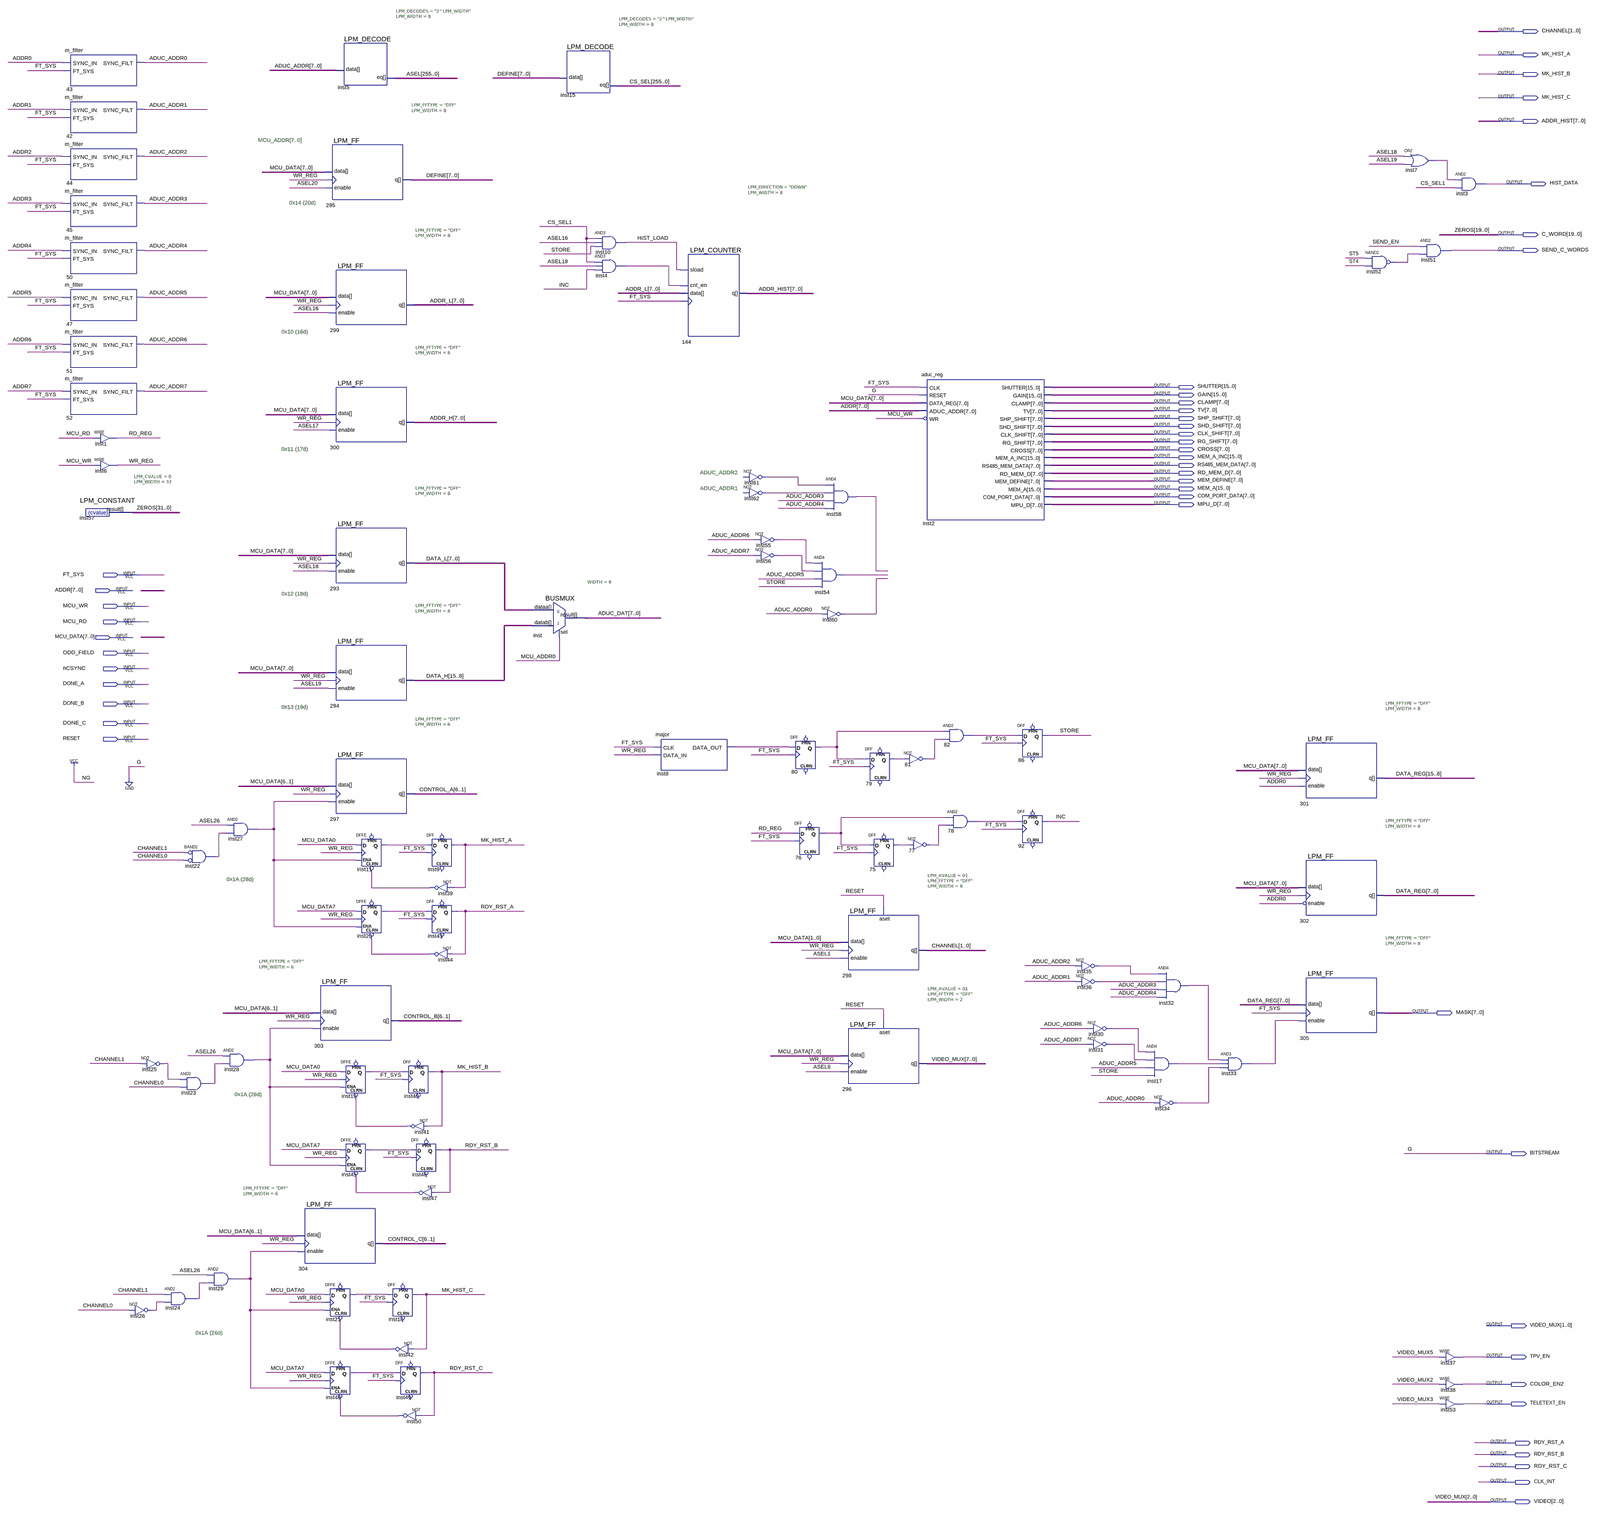
[diagram p0: schematic sheet, whole]
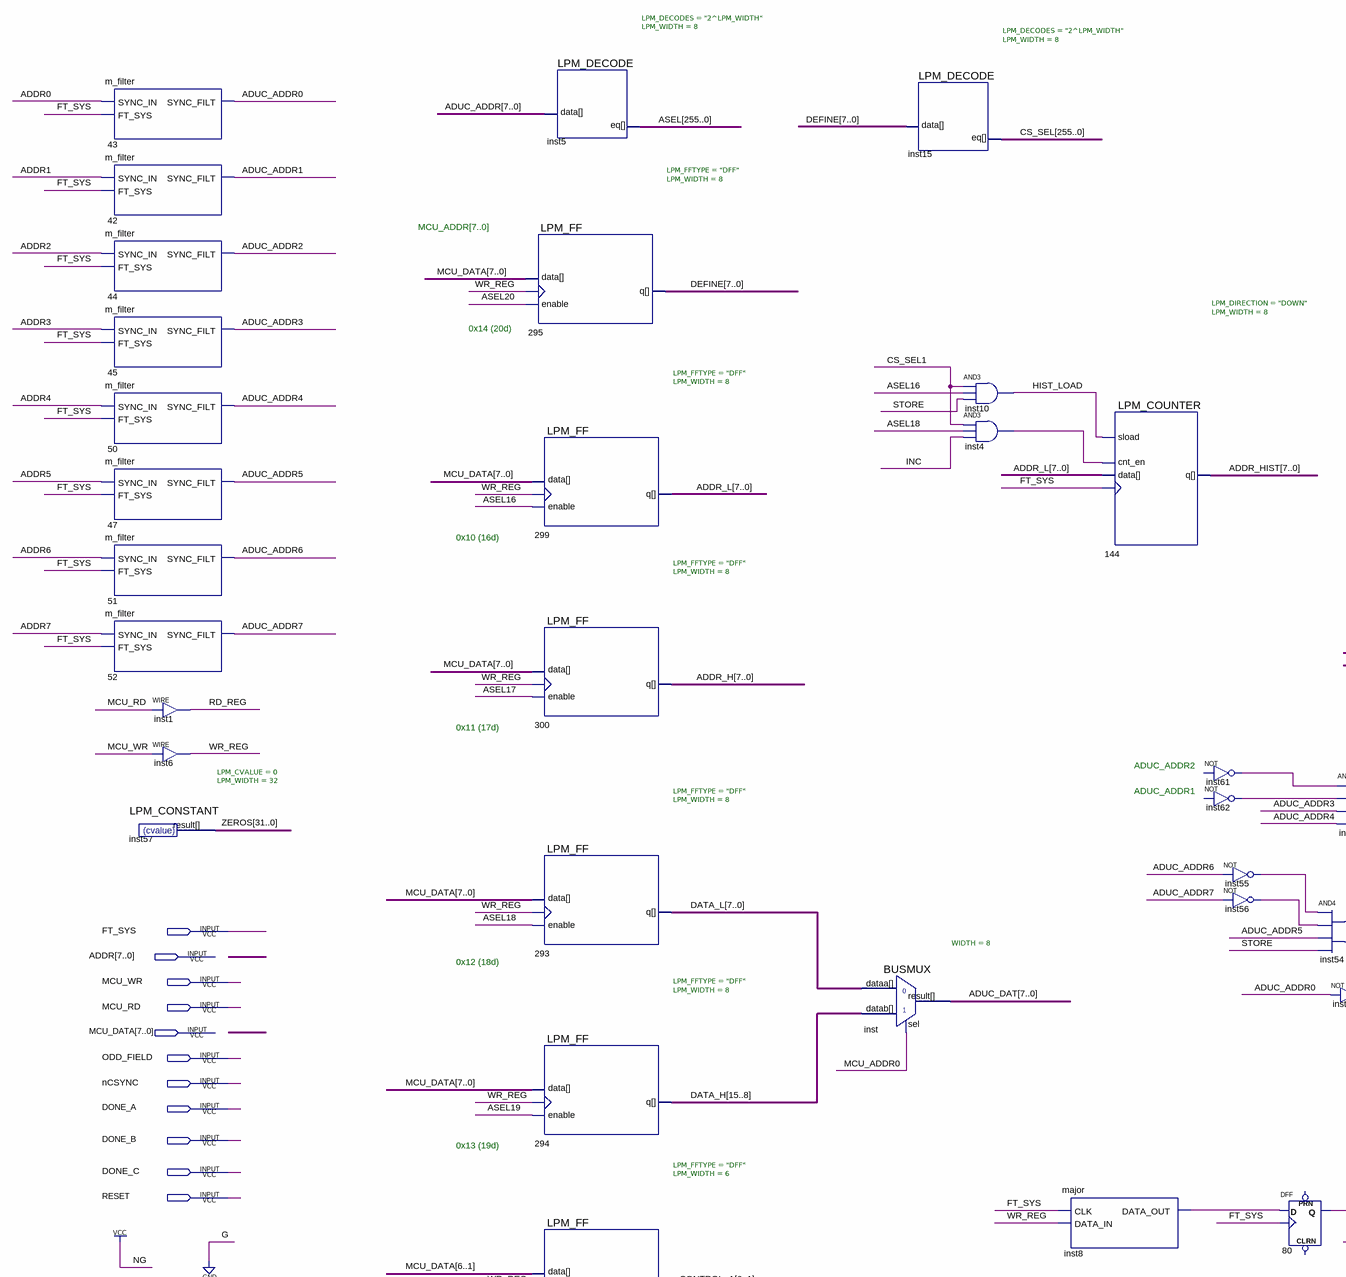
[diagram p1: schematic sheet, upper left part]
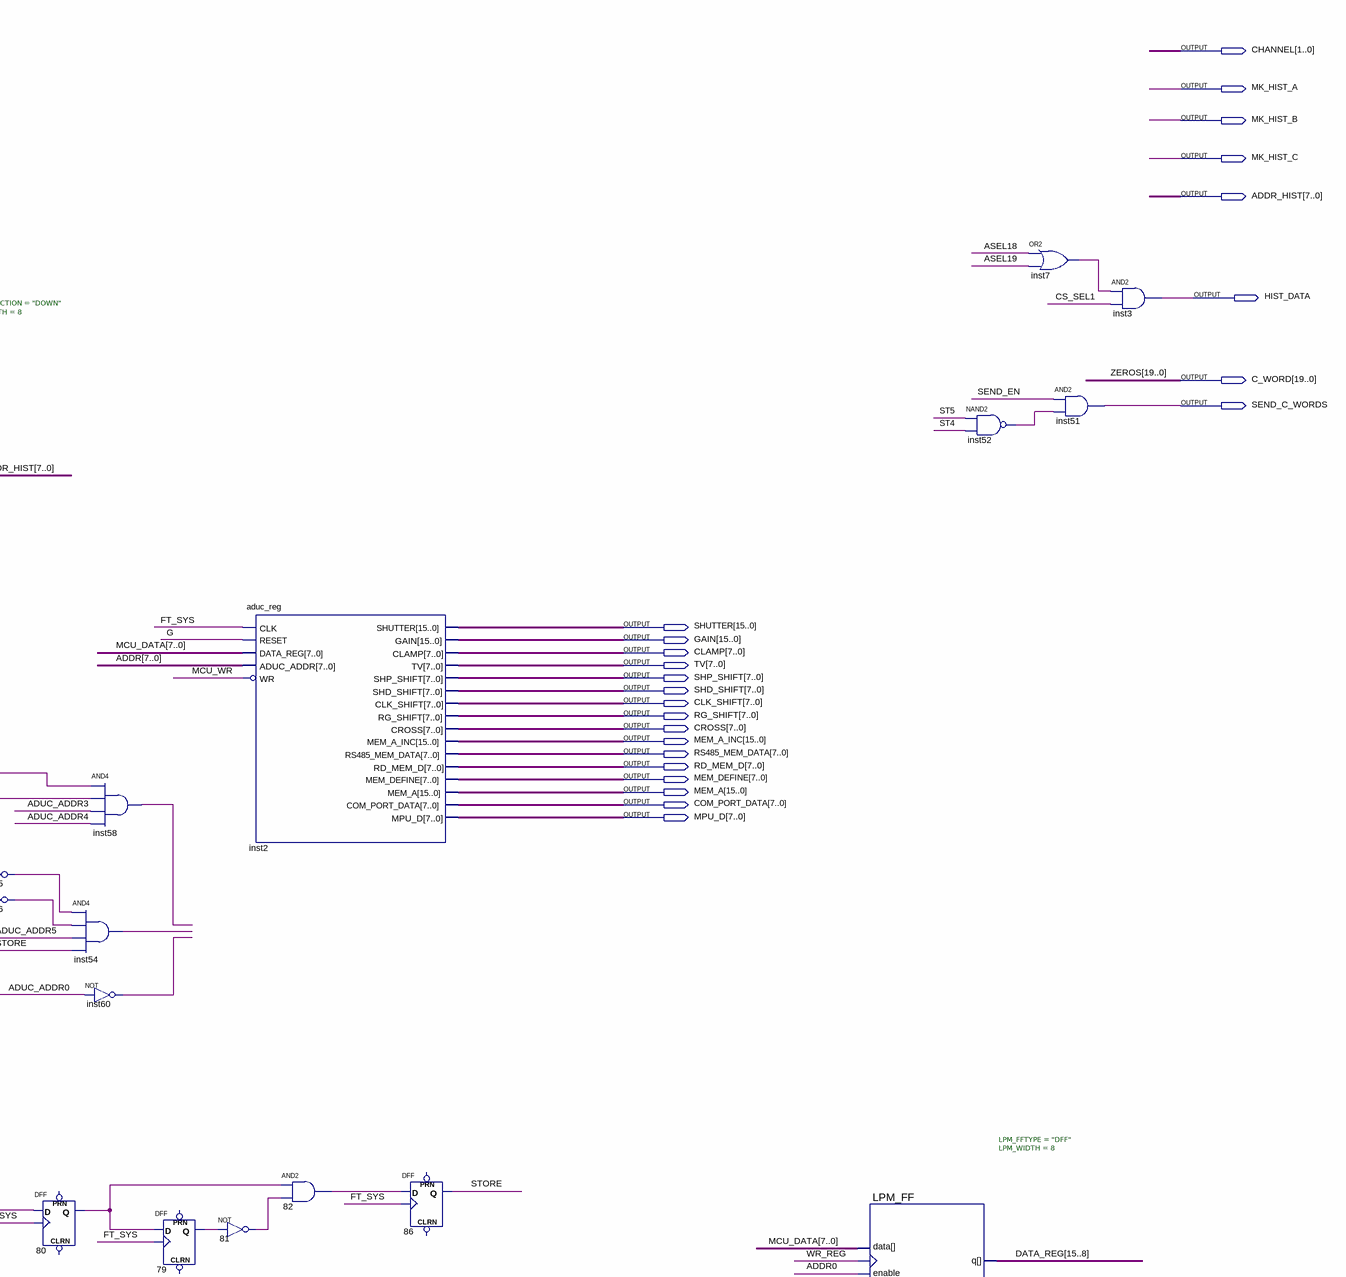
[diagram p2: schematic sheet, upper right part]
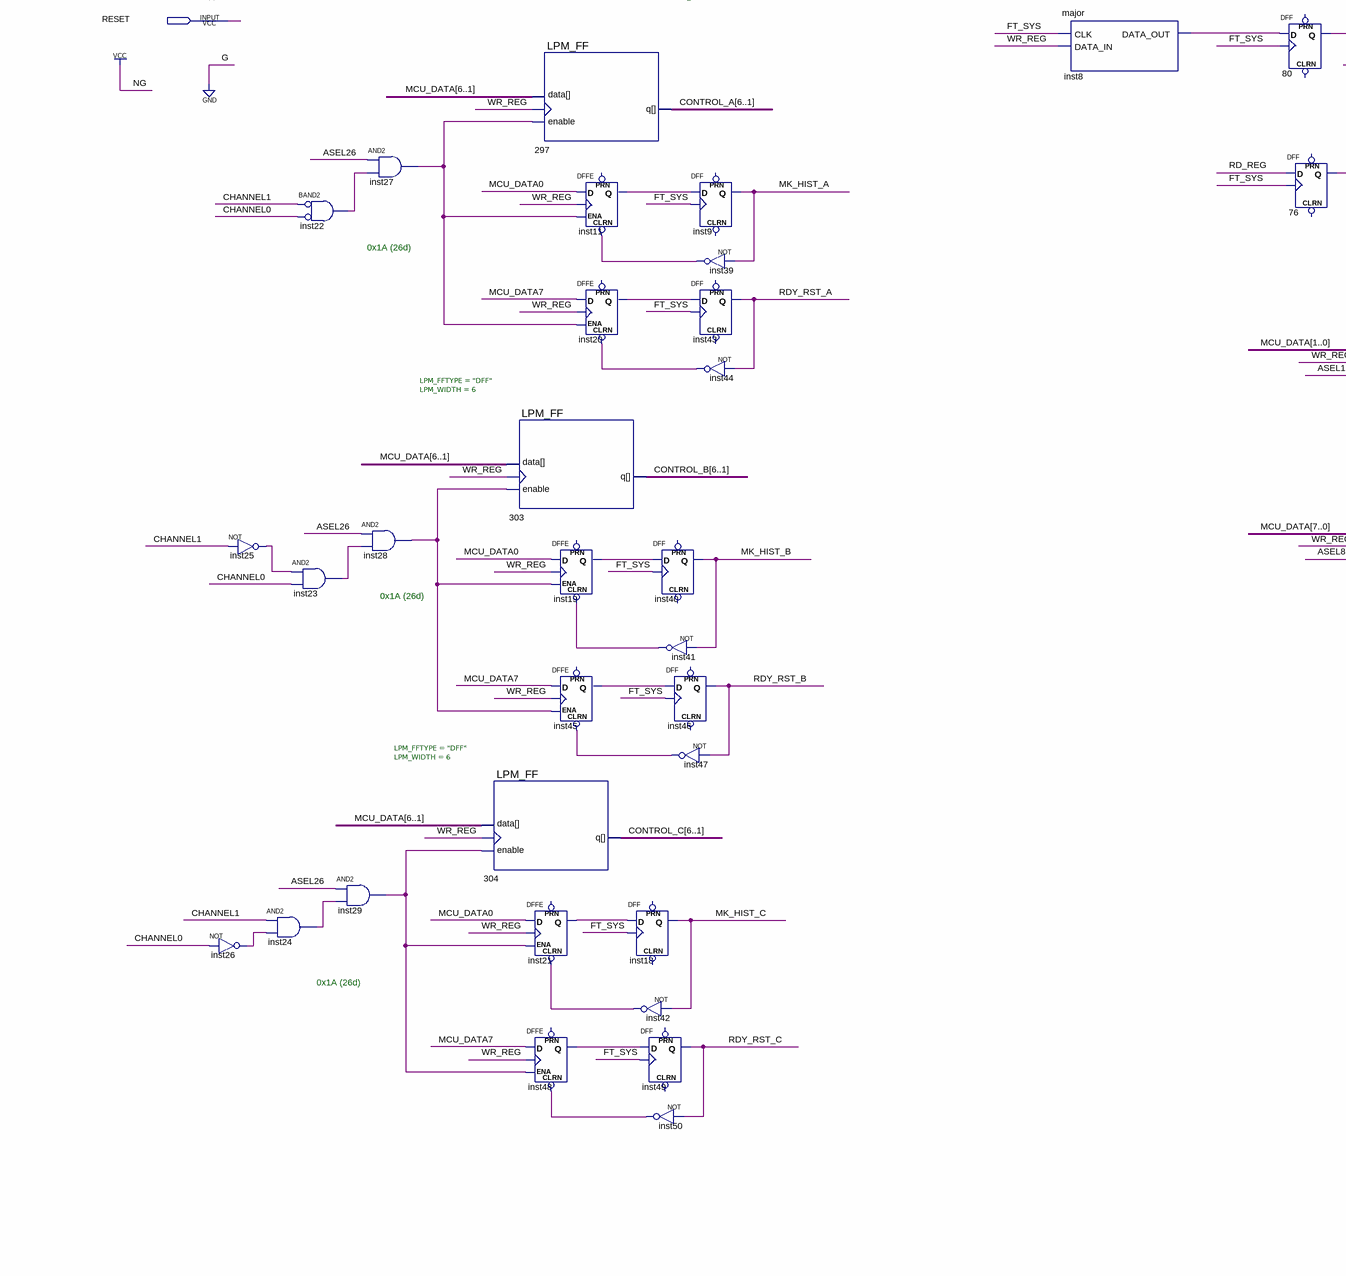
[diagram p3: schematic sheet, lower left part]
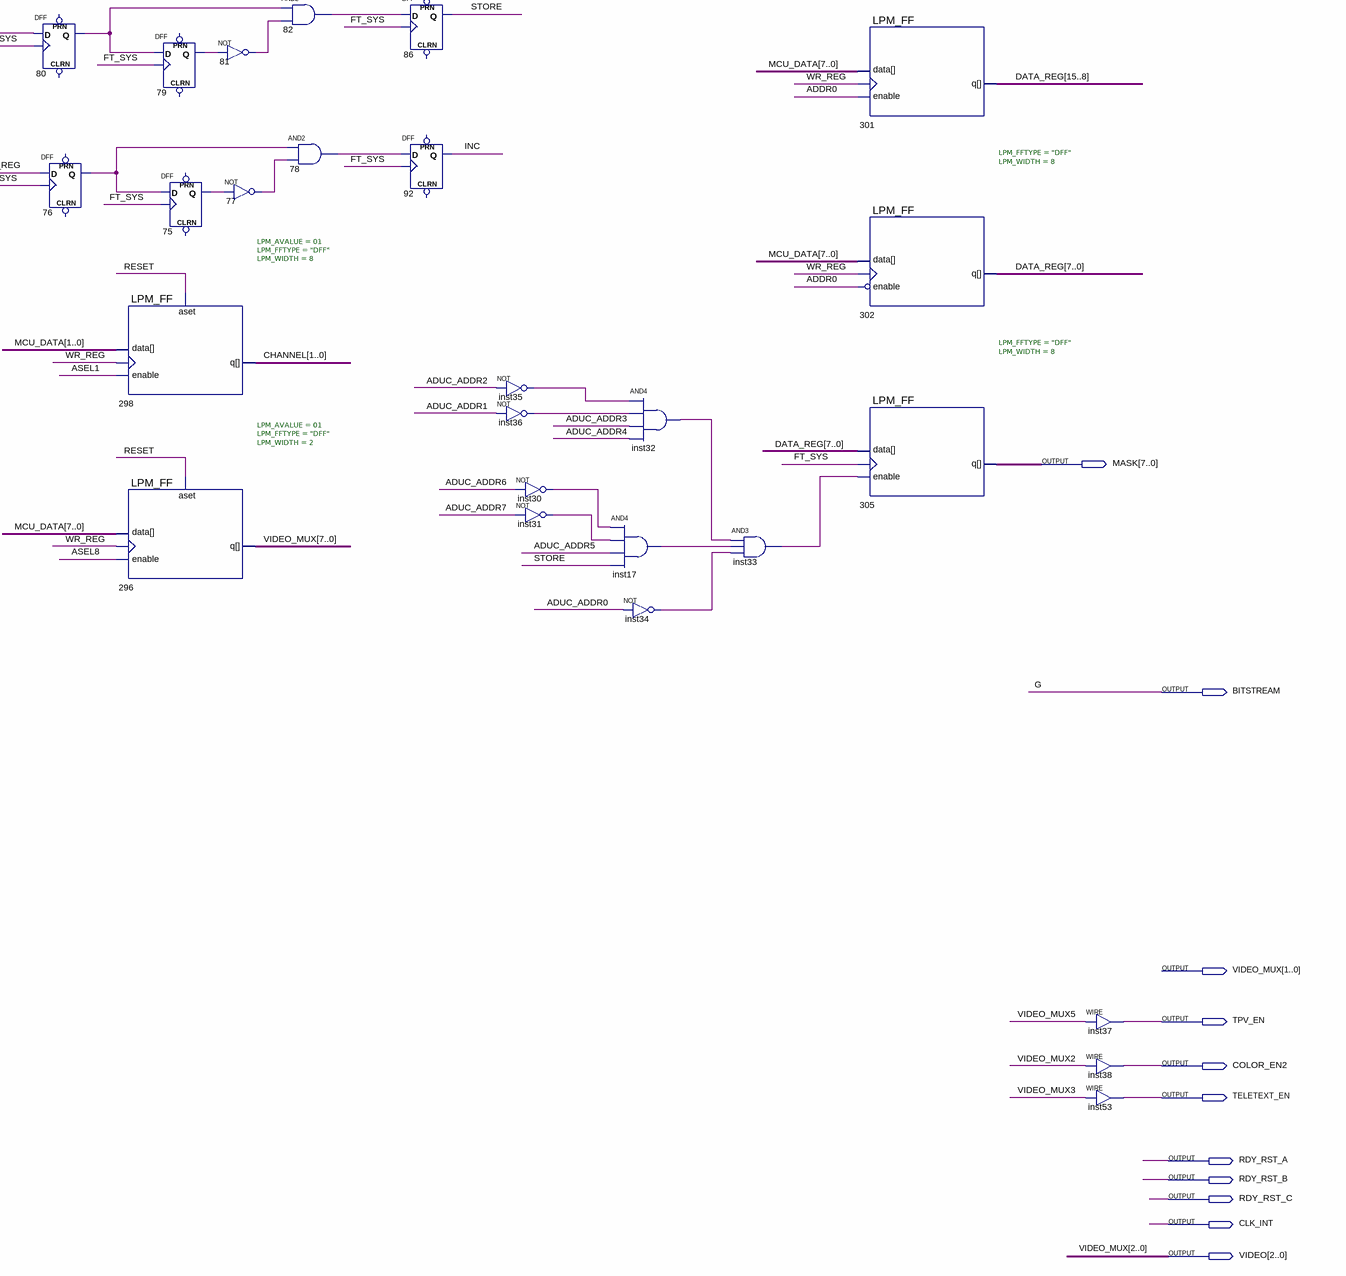
[diagram p4: schematic sheet, lower right part]
// Quartus schematic three_ctrl_k.bdf as structural Verilog: 90 symbols, 46 pins
module three_ctrl_k (
  input  FT_SYS,
  input  [7:0] ADDR,
  input  MCU_WR,
  input  MCU_RD,
  input  [7:0] MCU_DATA,
  input  ODD_FIELD,
  input  nCSYNC,
  input  DONE_A,
  input  DONE_B,
  input  DONE_C,
  input  RESET,
  output [1:0] CHANNEL,
  output MK_HIST_A,
  output MK_HIST_B,
  output MK_HIST_C,
  output [7:0] ADDR_HIST,
  output HIST_DATA,
  output [19:0] C_WORD,
  output SEND_C_WORDS,
  output [15:0] SHUTTER,
  output [15:0] GAIN,
  output [7:0] CLAMP,
  output [7:0] TV,
  output [7:0] SHP_SHIFT,
  output [7:0] SHD_SHIFT,
  output [7:0] CLK_SHIFT,
  output [7:0] RG_SHIFT,
  output [7:0] CROSS,
  output [15:0] MEM_A_INC,
  output [7:0] RS485_MEM_DATA,
  output [7:0] RD_MEM_D,
  output [7:0] MEM_DEFINE,
  output [15:0] MEM_A,
  output [7:0] COM_PORT_DATA,
  output [7:0] MPU_D,
  output [7:0] MASK,
  output BITSTREAM,
  output [7:0] VIDEO_MUX,
  output TPV_EN,
  output COLOR_EN2,
  output TELETEXT_EN,
  output RDY_RST_A,
  output RDY_RST_B,
  output RDY_RST_C,
  output CLK_INT,
  output [2:0] VIDEO
);

  wire HIST_LOAD, INC, inst4_out, inst7_out, inst8_data_out, inst11_q, inst17_out, inst19_q, inst20_q,
       inst21_q, inst22_out, inst23_out, inst24_out, inst25_out, inst26_out, inst27_out, inst28_out,
       inst29_out, inst30_out, inst31_out, inst32_out, inst33_out, inst34_out, inst35_out, inst36_out,
       inst39_out, inst41_out, inst42_out, inst44_out, inst45_q, inst47_out, inst48_q, inst50_out,
       inst52_out, inst54_out, inst55_out, inst56_out, inst58_out, inst60_out, inst61_out, inst62_out,
       MCU_ADDR0, n75_q, n76_q, n77_out, n78_out, n79_q, n80_q, n81_out, n82_out, RD_REG, SEND_EN, ST4, ST5,
       STORE, WR_REG;
  wire [6:1] CONTROL_A, CONTROL_B, CONTROL_C;
  wire [7:0] ADDR_H, ADDR_L, ADUC_ADDR, ADUC_DAT, DATA_L, DEFINE;
  wire [15:0] DATA_REG;
  wire [15:8] DATA_H;
  wire [31:20] ZEROS;
  wire [255:0] ASEL, CS_SEL;

  m_filter u_43 (.SYNC_IN(ADDR[0]), .FT_SYS(FT_SYS), .SYNC_FILT(ADUC_ADDR[0]));
  m_filter u_42 (.SYNC_IN(ADDR[1]), .FT_SYS(FT_SYS), .SYNC_FILT(ADUC_ADDR[1]));
  m_filter u_44 (.SYNC_IN(ADDR[2]), .FT_SYS(FT_SYS), .SYNC_FILT(ADUC_ADDR[2]));
  m_filter u_45 (.SYNC_IN(ADDR[3]), .FT_SYS(FT_SYS), .SYNC_FILT(ADUC_ADDR[3]));
  m_filter u_50 (.SYNC_IN(ADDR[4]), .FT_SYS(FT_SYS), .SYNC_FILT(ADUC_ADDR[4]));
  m_filter u_47 (.SYNC_IN(ADDR[5]), .FT_SYS(FT_SYS), .SYNC_FILT(ADUC_ADDR[5]));
  m_filter u_51 (.SYNC_IN(ADDR[6]), .FT_SYS(FT_SYS), .SYNC_FILT(ADUC_ADDR[6]));
  m_filter u_52 (.SYNC_IN(ADDR[7]), .FT_SYS(FT_SYS), .SYNC_FILT(ADUC_ADDR[7]));
  assign RD_REG = MCU_RD;  // WIRE inst1
  assign WR_REG = MCU_WR;  // WIRE inst6
  LPM_CONSTANT #(.LPM_CVALUE(0), .LPM_WIDTH(32)) inst57 (.result({ZEROS, C_WORD}));
  not inst26 (inst26_out, CHANNEL[0]);
  not inst25 (inst25_out, CHANNEL[1]);
  and inst24 (inst24_out, CHANNEL[1], inst26_out);
  and inst22 (inst22_out, ~CHANNEL[1], ~CHANNEL[0]);  // BAND2
  and inst23 (inst23_out, inst25_out, CHANNEL[0]);
  and inst27 (inst27_out, ASEL[26], inst22_out);
  and inst28 (inst28_out, ASEL[26], inst23_out);
  and inst29 (inst29_out, ASEL[26], inst24_out);
  LPM_FF #(.LPM_FFTYPE("DFF"), .LPM_WIDTH(8)) u_295 (.enable(ASEL[20]), .clock(WR_REG), .data(MCU_DATA), .q(DEFINE));
  LPM_FF #(.LPM_FFTYPE("DFF"), .LPM_WIDTH(6)) u_303 (
    .enable(inst28_out), .clock(WR_REG), .data(MCU_DATA[6:1]), .q(CONTROL_B));
  LPM_FF #(.LPM_FFTYPE("DFF"), .LPM_WIDTH(6)) u_304 (
    .enable(inst29_out), .clock(WR_REG), .data(MCU_DATA[6:1]), .q(CONTROL_C));
  DFFE inst21 (.CLRN(inst42_out), .D(MCU_DATA[0]), .CLK(WR_REG), .ENA(inst29_out), .Q(inst21_q));  // open: PRN
  DFFE inst48 (.CLRN(inst50_out), .D(MCU_DATA[7]), .CLK(WR_REG), .ENA(inst29_out), .Q(inst48_q));  // open: PRN
  LPM_DECODE #(.LPM_DECODES("2^LPM_WIDTH"), .LPM_WIDTH(8)) inst5 (.data(ADUC_ADDR), .eq(ASEL));
  LPM_FF #(.LPM_FFTYPE("DFF"), .LPM_WIDTH(8)) u_299 (.enable(ASEL[16]), .clock(WR_REG), .data(MCU_DATA), .q(ADDR_L));
  LPM_FF #(.LPM_FFTYPE("DFF"), .LPM_WIDTH(8)) u_300 (.enable(ASEL[17]), .clock(WR_REG), .data(MCU_DATA), .q(ADDR_H));
  LPM_FF #(.LPM_FFTYPE("DFF"), .LPM_WIDTH(8)) u_293 (.enable(ASEL[18]), .clock(WR_REG), .data(MCU_DATA), .q(DATA_L));
  LPM_FF #(.LPM_FFTYPE("DFF"), .LPM_WIDTH(8)) u_294 (.enable(ASEL[19]), .clock(WR_REG), .data(MCU_DATA), .q(DATA_H));
  LPM_FF #(.LPM_FFTYPE("DFF"), .LPM_WIDTH(6)) u_297 (
    .enable(inst27_out), .clock(WR_REG), .data(MCU_DATA[6:1]), .q(CONTROL_A));
  DFFE inst11 (.CLRN(inst39_out), .D(MCU_DATA[0]), .CLK(WR_REG), .ENA(inst27_out), .Q(inst11_q));  // open: PRN
  DFFE inst20 (.CLRN(inst44_out), .D(MCU_DATA[7]), .CLK(WR_REG), .ENA(inst27_out), .Q(inst20_q));  // open: PRN
  DFFE inst19 (.CLRN(inst41_out), .D(MCU_DATA[0]), .CLK(WR_REG), .ENA(inst28_out), .Q(inst19_q));  // open: PRN
  DFFE inst45 (.CLRN(inst47_out), .D(MCU_DATA[7]), .CLK(WR_REG), .ENA(inst28_out), .Q(inst45_q));  // open: PRN
  DFF inst18 (.CLK(FT_SYS), .D(inst21_q), .Q(MK_HIST_C));  // open: CLRN, PRN
  DFF inst40 (.CLK(FT_SYS), .D(inst19_q), .Q(MK_HIST_B));  // open: CLRN, PRN
  not inst41 (inst41_out, MK_HIST_B);
  DFF inst46 (.CLK(FT_SYS), .D(inst45_q), .Q(RDY_RST_B));  // open: CLRN, PRN
  not inst47 (inst47_out, RDY_RST_B);
  not inst42 (inst42_out, MK_HIST_C);
  DFF inst49 (.CLK(FT_SYS), .D(inst48_q), .Q(RDY_RST_C));  // open: CLRN, PRN
  not inst50 (inst50_out, RDY_RST_C);
  DFF inst9 (.CLK(FT_SYS), .D(inst11_q), .Q(MK_HIST_A));  // open: CLRN, PRN
  not inst39 (inst39_out, MK_HIST_A);
  DFF inst43 (.CLK(FT_SYS), .D(inst20_q), .Q(RDY_RST_A));  // open: CLRN, PRN
  not inst44 (inst44_out, RDY_RST_A);
  BUSMUX #(.WIDTH(8)) inst (.datab(DATA_H), .sel(MCU_ADDR0), .dataa(DATA_L), .result(ADUC_DAT));
  LPM_DECODE #(.LPM_DECODES("2^LPM_WIDTH"), .LPM_WIDTH(8)) inst15 (.data(DEFINE), .eq(CS_SEL));
  and inst10 (HIST_LOAD, CS_SEL[1], ASEL[16], STORE);
  and inst4 (inst4_out, CS_SEL[1], ASEL[18], INC);
  major inst8 (.CLK(FT_SYS), .DATA_IN(WR_REG), .DATA_OUT(inst8_data_out));
  LPM_COUNTER #(.LPM_DIRECTION("DOWN"), .LPM_WIDTH(8)) u_144 (
    .sload(HIST_LOAD), .cnt_en(inst4_out), .data(ADDR_L), .clock(FT_SYS), .q(ADDR_HIST));
  // NOT inst61 has open pins: IN=open, OUT=inst61_out
  // NOT inst62 has open pins: IN=open, OUT=inst62_out
  not inst55 (inst55_out, ADUC_ADDR[6]);
  not inst56 (inst56_out, ADUC_ADDR[7]);
  DFF u_80 (.CLK(FT_SYS), .D(inst8_data_out), .Q(n80_q));  // open: CLRN, PRN
  DFF u_76 (.CLK(FT_SYS), .D(RD_REG), .Q(n76_q));  // open: CLRN, PRN
  and inst58 (inst58_out, inst61_out, inst62_out, ADUC_ADDR[3], ADUC_ADDR[4]);
  and inst54 (inst54_out, inst55_out, inst56_out, ADUC_ADDR[5], STORE);
  not inst60 (inst60_out, ADUC_ADDR[0]);
  LPM_FF #(.LPM_AVALUE(01), .LPM_FFTYPE("DFF"), .LPM_WIDTH(2)) u_298 (
    .enable(ASEL[1]), .clock(WR_REG), .aset(RESET), .data(MCU_DATA[1:0]), .q(CHANNEL));
  LPM_FF #(.LPM_AVALUE(01), .LPM_FFTYPE("DFF"), .LPM_WIDTH(8)) u_296 (
    .enable(ASEL[8]), .clock(WR_REG), .aset(RESET), .data(MCU_DATA), .q({VIDEO_MUX[7:3], VIDEO}));
  DFF u_79 (.CLK(FT_SYS), .D(n80_q), .Q(n79_q));  // open: CLRN, PRN
  DFF u_75 (.CLK(FT_SYS), .D(n76_q), .Q(n75_q));  // open: CLRN, PRN
  aduc_reg inst2 (
    .CLK(FT_SYS), .RESET(1'b0), .DATA_REG(MCU_DATA), .ADUC_ADDR(ADDR), .WR(~MCU_WR), .SHUTTER(SHUTTER),
    .GAIN(GAIN), .CLAMP(CLAMP), .TV(TV), .SHP_SHIFT(SHP_SHIFT), .SHD_SHIFT(SHD_SHIFT), .CLK_SHIFT(CLK_SHIFT),
    .RG_SHIFT(RG_SHIFT), .CROSS(CROSS), .MEM_A_INC(MEM_A_INC), .RS485_MEM_DATA(RS485_MEM_DATA),
    .RD_MEM_D(RD_MEM_D), .MEM_DEFINE(MEM_DEFINE), .MEM_A(MEM_A), .COM_PORT_DATA(COM_PORT_DATA), .MPU_D(MPU_D));
  not u_81 (n81_out, n79_q);
  not u_77 (n77_out, n75_q);
  and u_82 (n82_out, n80_q, n81_out);
  and u_78 (n78_out, n76_q, n77_out);
  DFF u_86 (.CLK(FT_SYS), .D(n82_out), .Q(STORE));  // open: CLRN, PRN
  DFF u_92 (.CLK(FT_SYS), .D(n78_out), .Q(INC));  // open: CLRN, PRN
  not inst35 (inst35_out, ADUC_ADDR[2]);
  not inst36 (inst36_out, ADUC_ADDR[1]);
  not inst30 (inst30_out, ADUC_ADDR[6]);
  not inst31 (inst31_out, ADUC_ADDR[7]);
  and inst32 (inst32_out, inst35_out, inst36_out, ADUC_ADDR[3], ADUC_ADDR[4]);
  and inst17 (inst17_out, inst30_out, inst31_out, ADUC_ADDR[5], STORE);
  not inst34 (inst34_out, ADUC_ADDR[0]);
  and inst33 (inst33_out, inst32_out, inst17_out, inst34_out);
  LPM_FF #(.LPM_FFTYPE("DFF"), .LPM_WIDTH(8)) u_301 (
    .enable(ADDR[0]), .clock(WR_REG), .data(MCU_DATA), .q(DATA_REG[15:8]));
  LPM_FF #(.LPM_FFTYPE("DFF"), .LPM_WIDTH(8)) u_302 (
    .enable(~ADDR[0]), .clock(WR_REG), .data(MCU_DATA), .q(DATA_REG[7:0]));
  LPM_FF #(.LPM_FFTYPE("DFF"), .LPM_WIDTH(8)) u_305 (
    .enable(inst33_out), .clock(FT_SYS), .data(DATA_REG[7:0]), .q(MASK));
  nand inst52 (inst52_out, ST5, ST4);
  or inst7 (inst7_out, ASEL[18], ASEL[19]);
  and inst51 (SEND_C_WORDS, SEND_EN, inst52_out);
  assign TPV_EN = VIDEO_MUX[5];  // WIRE inst37
  assign COLOR_EN2 = VIDEO[2];  // WIRE inst38
  assign TELETEXT_EN = VIDEO_MUX[3];  // WIRE inst53
  and inst3 (HIST_DATA, inst7_out, CS_SEL[1]);

  assign BITSTREAM = 1'b0;
  assign VIDEO_MUX[1:0] = VIDEO[1:0];

  // Other names for the same wires on the sheet: VIDEO_MUX[2] = VIDEO[2]; VIDEO_MUX2 = VIDEO[2]; ZEROS[19:0] = C_WORD

  // Notes on the sheet:
  //   MCU_ADDR[7..0]
  //   0x14 (20d)
  //   0x10 (16d)
  //   0x11 (17d)
  //   ADUC_ADDR2
  //   ADUC_ADDR1
  //   0x12 (18d)
  //   0x13 (19d)
  //   0x1A (26d)
  //   0x1A (26d)
  //   0x1A (26d)
endmodule
